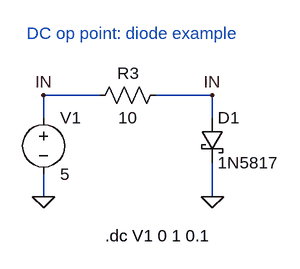
[diagram p0: schematic LTspice 03-1 DC op point example2b.asc]
LTspice 03-1 DC op point example2b.asc, the LTspice schematic file:
Version 4
SHEET 1 2084 680
WIRE 944 240 864 240
WIRE 1104 240 1024 240
WIRE 864 272 864 240
WIRE 1104 272 1104 240
WIRE 864 384 864 352
WIRE 1104 384 1104 336
FLAG 864 384 0
FLAG 864 240 IN
FLAG 1104 240 IN
FLAG 1104 384 0
SYMBOL voltage 864 256 R0
WINDOW 123 0 0 Left 2
WINDOW 39 0 0 Left 2
SYMATTR InstName V1
SYMATTR Value 5
SYMBOL res 928 256 R270
WINDOW 0 32 56 VTop 2
WINDOW 3 0 56 VBottom 2
SYMATTR InstName R3
SYMATTR Value 10
SYMBOL schottky 1088 272 R0
SYMATTR InstName D1
SYMATTR Value 1N5817
SYMATTR Description Diode
SYMATTR Type diode
TEXT 840 152 Left 2 ;DC op point: diode example
TEXT 952 440 Left 2 !.dc V1 0 1 0.1

The netlist it stands for:
* LTspice 03-1 DC op point example2b.asc
V1 IN 0 5
R3 IN IN 10
D1 IN 0 1N5817
.model D D
.lib standard.dio
* DC op point: diode example
.dc V1 0 1 0.1
.backanno
.end